# EAGLE design mini-DIN-8 breakout (EAGLE 9.3.0)
PC Engine Joypad Breakout Version 1.0
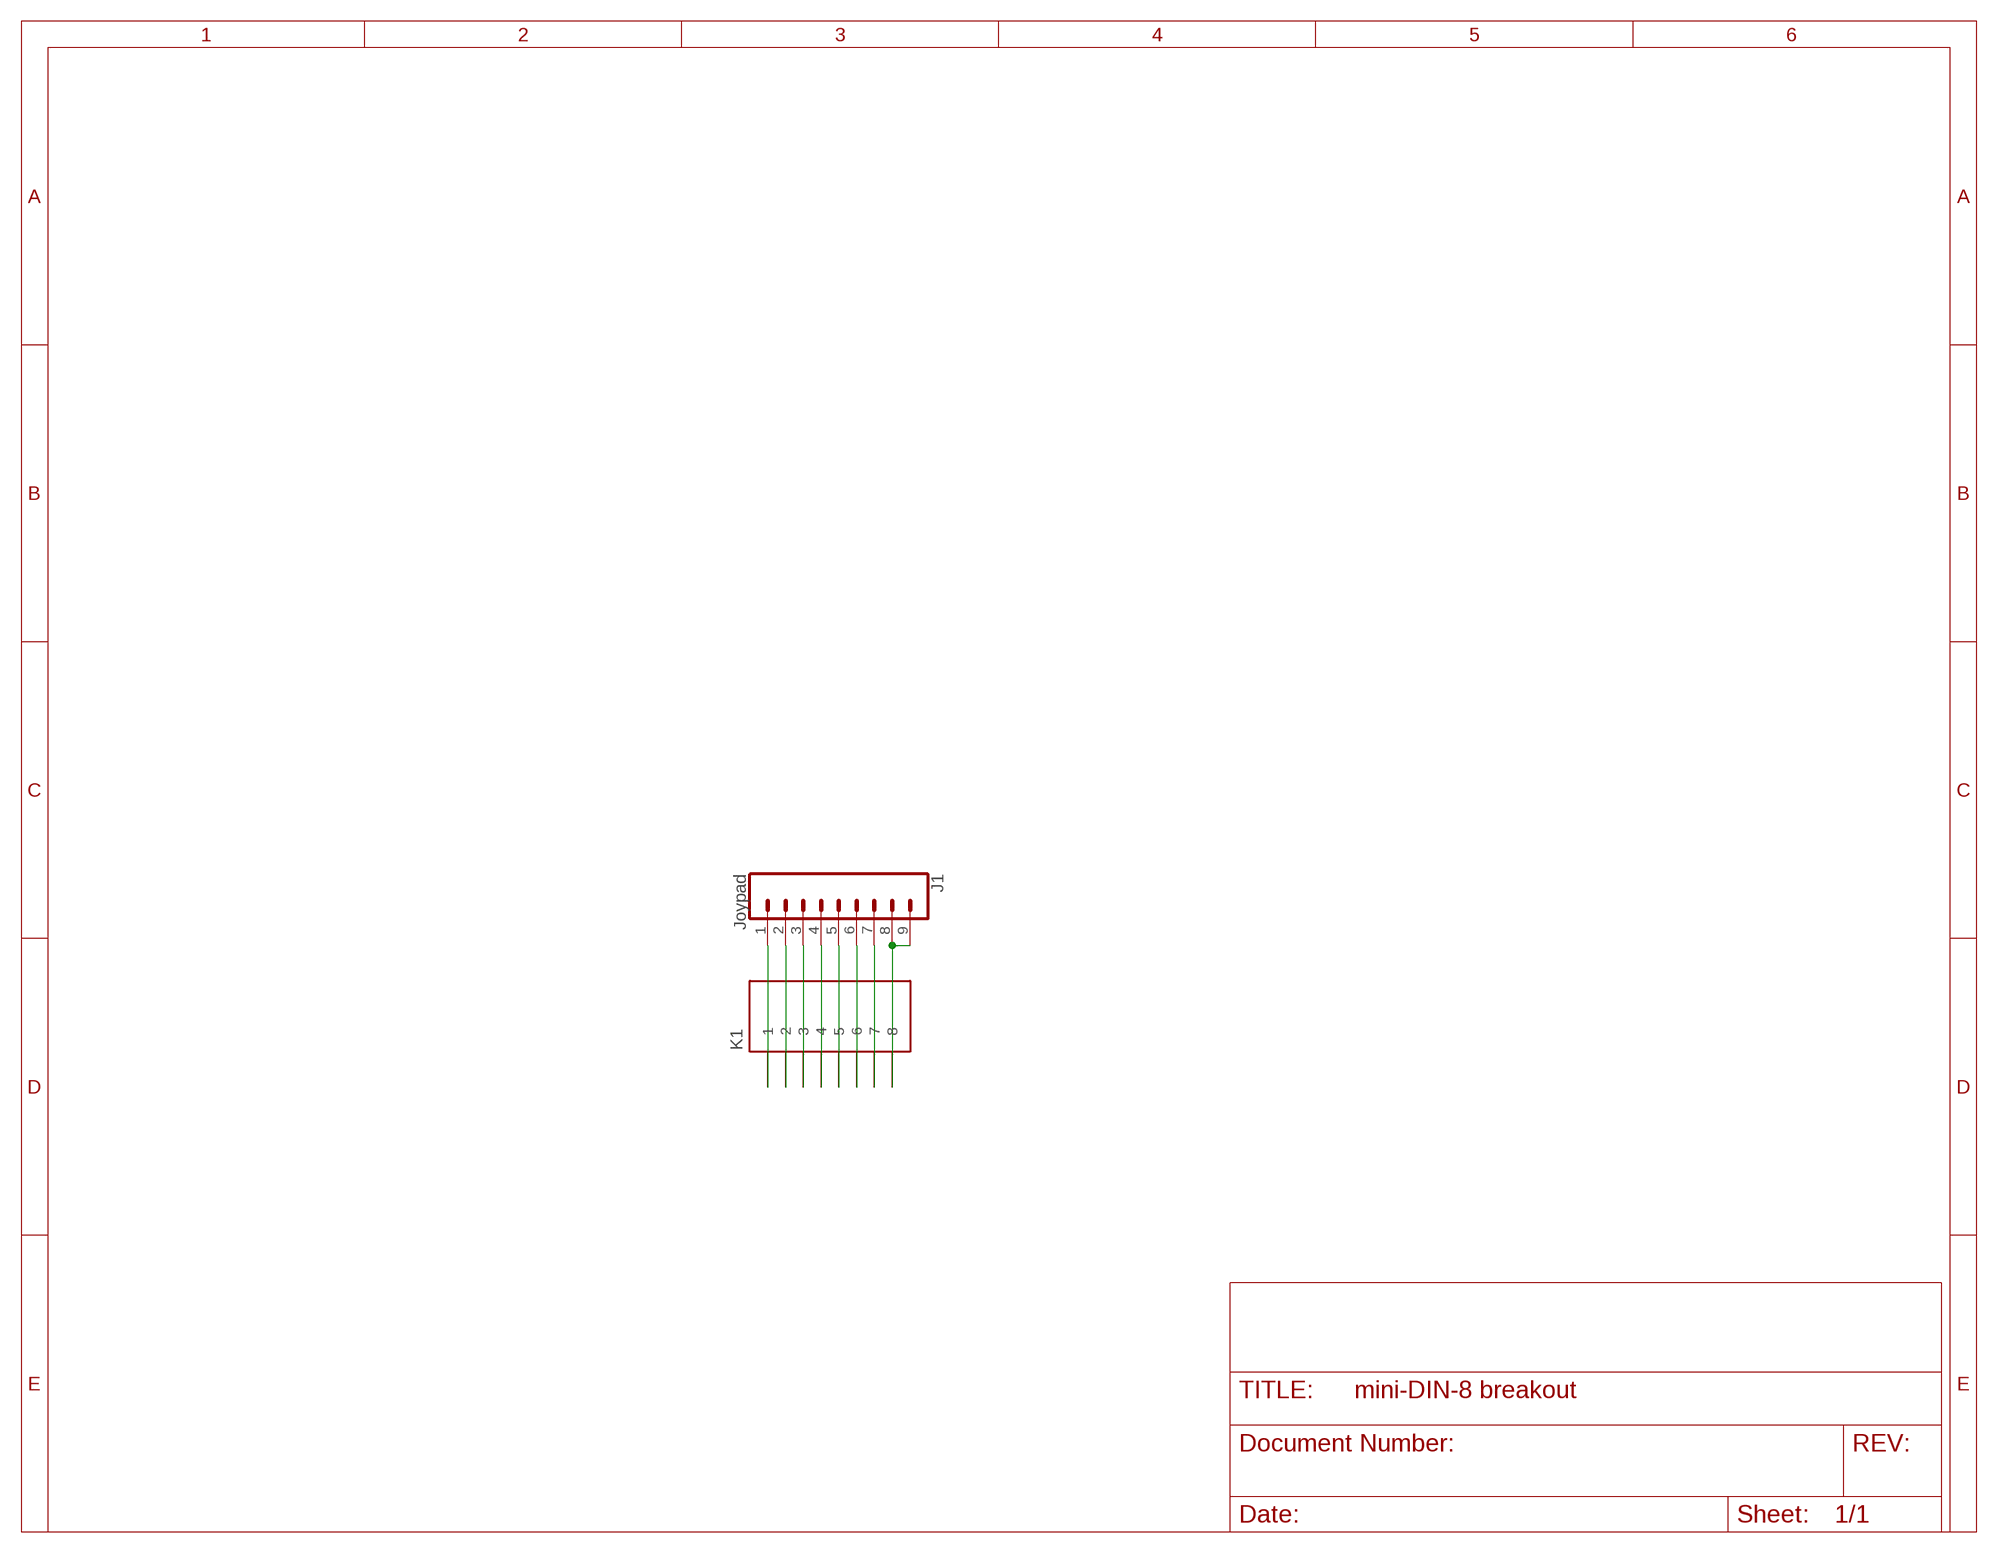
[diagram p0: schematic, sheet 1]

## Parts
J1  Joypad  CONN_09  [1X09]
K1  631008112021  [631008112021]

## Nets
GND [power]: J1.8 J1.9 K1.6
N$8: J1.2 K1.1
N$11: J1.3 K1.5
N$13: J1.4 K1.7
N$15: J1.5 K1.3
N$16: J1.6 K1.8
N$25: J1.7 K1.4
N$28 [power]: J1.1 K1.2

## Library data of the parts
J1 = SparkFun-Connectors:CONN_09: Multi connection point. Often used as Generic Header-pin footprint for 0.1 inch spaced/style header connections On any of the 0.1 inch spaced packages, you can populate with these: Break Away Headers - Straight <https://www.sparkfun.com/products/116> (PRT-00116) Break Away Male Headers - Right Angle <https://www.sparkfun.com/products/553> (PRT-00553) Female Headers <https://www.sparkfun.com/products/115> (PRT-00115) Break Away Headers - Machine Pin <https://www.sparkfun.com/products/117> (PRT-00117) Break Away Female Headers - Swiss Machine Pin <https://www.sparkfun.com/products/743> (PRT-00743) For SCREWTERMINALS and SPRING TERMINALS visit here: Screw Terimnals on SparkFun.com <https://www.sparkfun.com/search/results?term=Screw+Terminals> (5mm/3.5mm/2.54mm spacing) This device is also useful as a general connection point to wire up your design to another part of your project. Our various solder wires solder well into these plated through hole pads. Hook-Up Wire - Assortment (Stranded, 22 AWG) <https://www.sparkfun.com/products/11375> (PRT-11375) Hook-Up Wire - Assortment (Solid Core, 22 AWG) <https://www.sparkfun.com/products/11367> (PRT-11367) View the entire wire category on our website here <https://www.sparkfun.com/categories/141> Special notes: Molex polarized connector foot print use with SKU : PRT-08231 with associated crimp pins and housings. 1MM SMD Version SKU: PRT-10208 NOTES ON THE VARIANTS LOCK and LOCK_LONGPADS... This footprint was designed to help hold the alignment of a through-hole component (i.e. 6-pin header) while soldering it into place. You may notice that each hole has been shifted either up or down by 0.005 of an inch from it's more standard position (which is a perfectly straight line). This slight alteration caused the pins (the squares in the middle) to touch the edges of the holes. Because they are alternating, it causes a "brace" to hold the component in place. 0.005 has proven to be the perfect amount of "off-center" position when using our standard breakaway headers. Although looks a little odd when you look at the bare footprint, once you have a header in there, the alteration is very hard to notice. Also,if you push a header all the way into place, it is covered up entirely on the bottom side.
K1 = Wuerth_Elektronik_eiCan_Communication_Connectors_v2.2:631008112021: WR-COM Horizontal Shielded Mini DIN, 8 pins

## Net classes
0 default: width 0.305 mm, drill 0.356 mm, clearance 0.305 mm
1 breadboard: width 1.016 mm, drill 0.356 mm, clearance 0.305 mm
2 power: width 0.305 mm, drill 0.356 mm, clearance 0.305 mm
3 signal: width 0.203 mm, drill 0.356 mm, clearance 0.305 mm

## Board
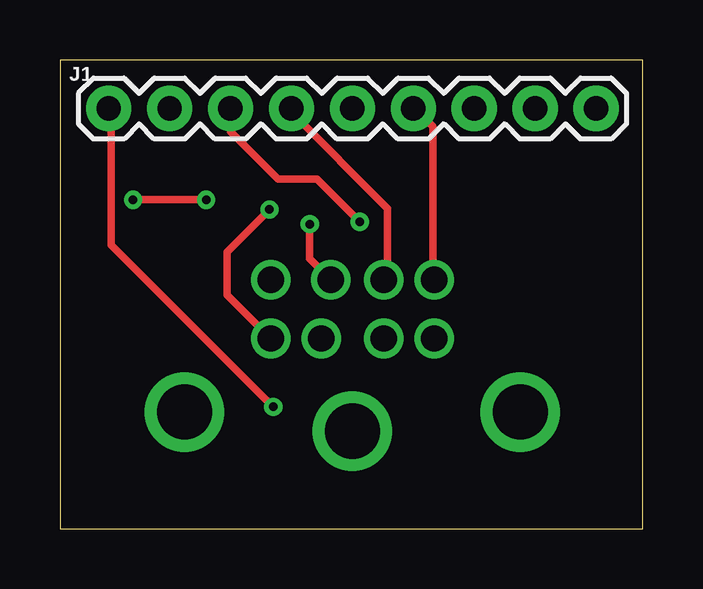
[diagram p1: board, top side]
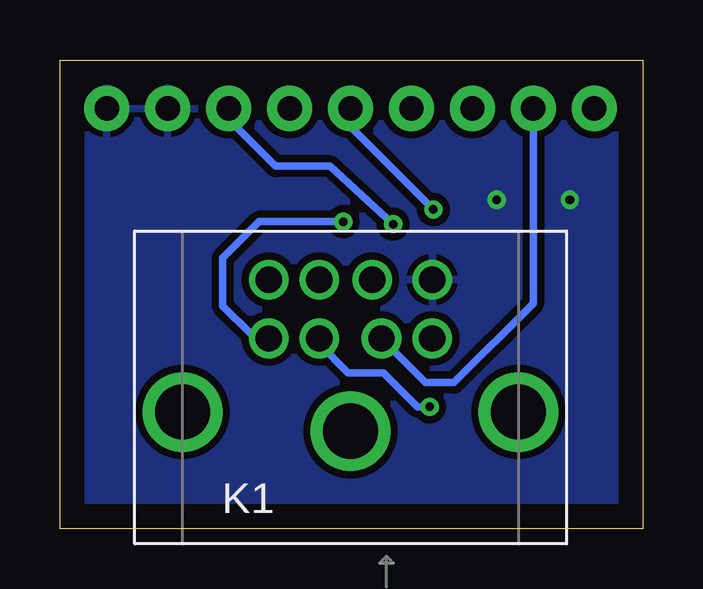
[diagram p2: board, bottom side, seen from below]

Size 24.31 x 19.55 mm. Coordinates in mm from the lower left corner, seen from the top.
Outline: 0,0 24.31,0 24.31,19.55 0,19.55 0,0
Copper layers (1*16): Top 0.035mm / dielectric 1.5mm / Bottom 0.035mm
Design rules "default": minimum track width 6mil, minimum drill 0.35mm, track to track 6mil, track to pad 6mil, pad to pad 6mil, via to via 6mil, smd to smd 6mil, copper to edge 40mil, drill to drill 6mil, minimum pad ring 10mil, minimum via ring 8mil, stop-mask expansion 4mil, vias tented up to drill 0mil, thermal gap 10mil

### Footprints (pad centres in the part's own frame; a part is rotated, then mirrored left to right if it is on the bottom)
1X09 = drill 1.016 pad 1.88: 1 0,0; 2 2.54,0; 3 5.08,0; 4 7.62,0; 5 10.16,0; 6 12.7,0; 7 15.24,0; 8 17.78,0; 9 20.32,0
631008112021 = drill 1.1: 1 -1.29,-8.57; 2 1.3,-8.57; 3 -3.405,-8.57; 4 -0.9,-11.02; 5 3.405,-8.57; 6 -3.405,-11.02; 7 1.3,-11.02; 8 3.405,-11.02 | drill 2.3: Z1 0,-4.7; Z2 -7,-5.5; Z3 7,-5.5

### Placement (x,y rotation side)
J1  2.03,17.53 0 top
K1  12.19,-0.64 180 bottom

### Tracks (layer width: path | path; a pad name or v marks a point on that pad's centre or on a via)
GND  (via drill 0.36)
  Top 0.305: v3.05,13.72 v6.1,13.72
  pour Bottom: -0.38,20.07 24.89,20.07 24.89,-0.38 -0.38,-0.38
N$8
  Bottom 0.305: J1.2 4.57,9.4 7.87,6.1 9.06,6.1 K1.1
N$11  (via drill 0.36)
  Top 0.305: v12.5,12.8 10.72,14.58 9.09,14.58 7.11,16.56 J1.3
  Bottom 0.305: v12.5,12.8 16,12.8 17.53,11.28 17.53,9.3 16.31,8.08 15.7,8.08 K1.5
N$13
  Top 0.305: K1.7 13.66,10.56 13.66,13.36 9.65,17.37 J1.4
N$15  (via drill 0.36)
  Top 0.305: K1.3 8.78,7.93 6.96,9.75 6.96,11.53 v8.74,13.31
  Bottom 0.305: v8.74,13.31 12.19,16.76 J1.5
N$16
  Top 0.305: K1.8 15.54,10.52 15.54,16.76 14.78,17.53 J1.6
N$25  (via drill 0.36)
  Top 0.305: v10.41,12.7 10.41,11.26 K1.4
  Bottom 0.305: v10.41,12.7 13.05,15.11 15.31,15.11 17.27,17.07 J1.7
N$28  (via drill 0.36)
  Top 0.305: J1.1 2.13,17.53 2.13,11.84 v8.89,5.08
  Bottom 0.305: v8.89,5.08 9.4,5.08 10.82,6.5 12.3,6.5 13.49,7.7 K1.2

### Text on the board
tValues: +5V | D0 | D1 | D2 | D3 | SEL | CLR | GND | GND
bValues: PCE Joypad v.2 | (c) 2019, David Shadoff